# Altium schematic sheet [05] - HMI.SchDoc: =ProjectName
size A4; CheckedBy: Ven; Author: Ven; CompanyName: HUST; Revision: V.1.0
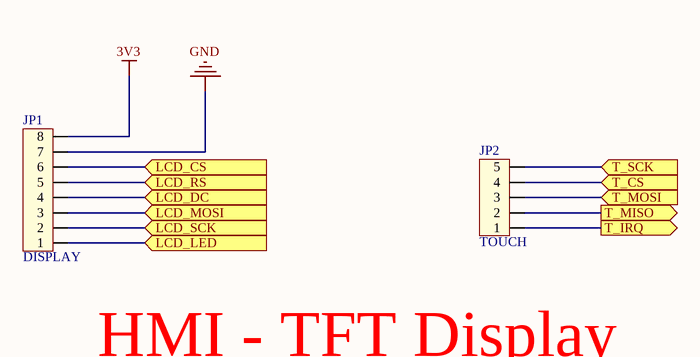
[diagram p0: [05] - HMI.SchDoc]

## Parts
JP1  DISPLAY  [CON8]
JP2  TOUCH  [CON5]

## Ports
LCD_CS (in), LCD_DC (in), LCD_LED (in), LCD_MOSI (in), LCD_RS (in), LCD_SCK (in), T_CS (in), T_IRQ (out), T_MISO (out), T_MOSI (in), T_SCK (in)

## Nets
3V3: JP1.8
GND: JP1.7
LCD_CS: JP1.6 ; port LCD_CS
LCD_DC: JP1.4 ; port LCD_DC
LCD_LED: JP1.1 ; port LCD_LED
LCD_MOSI: JP1.3 ; port LCD_MOSI
LCD_RS: JP1.5 ; port LCD_RS
LCD_SCK: JP1.2 ; port LCD_SCK
T_CS: JP2.4 ; port T_CS
T_IRQ: JP2.1 ; port T_IRQ
T_MISO: JP2.2 ; port T_MISO
T_MOSI: JP2.3 ; port T_MOSI
T_SCK: JP2.5 ; port T_SCK

## Notes on the sheet
- HMI - TFT Display
- Project:
- Page Contents:
- Size:
- Date:
- A4
- Checked by:
- Time:
- Revision:
- Sheet
- of
- File:

## Library data of the parts
JP1 = Con8: Connector 8; Value: Connector 8
JP2 = Con5: Connector 5; Value: Connector 5